# Altium schematic sheet SignalGen_SingleChannel.SchDoc
size A; SheetNumber: 2; SheetTotal: 2
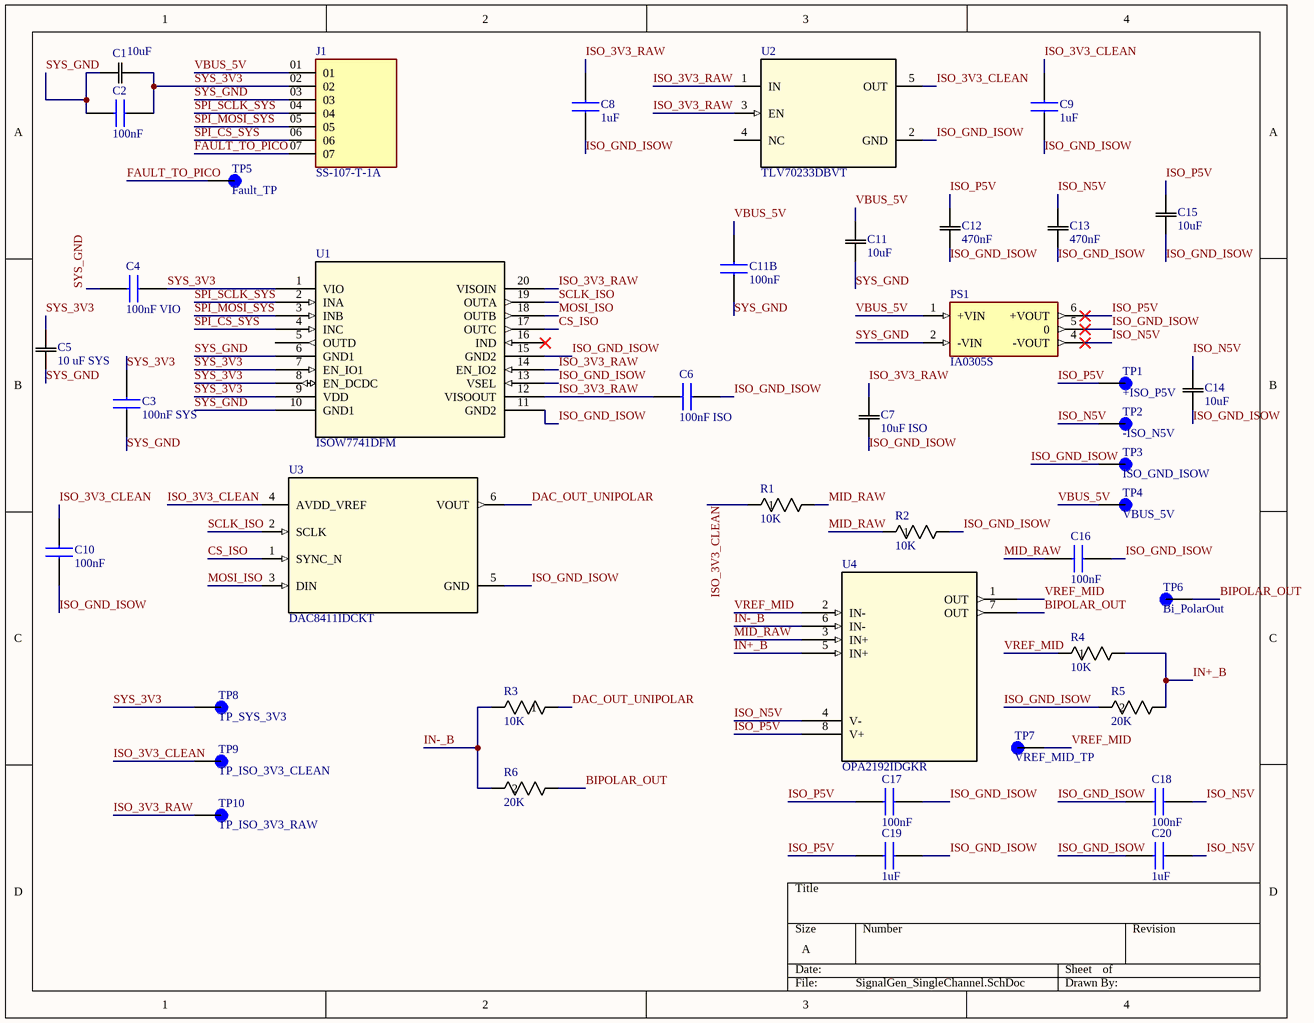
[diagram p0: SignalGen_SingleChannel.SchDoc]

## Parts
C1  10uF  [G-21_MUR]
C2  100nF  [CAPC1608X90N]
C3  100nF SYS  [CAPC1608X90N]
C4  100nF VIO  [CAPC1608X90N]
C5  10 uF SYS  [G-21_MUR]
C6  100nF ISO  [CAPC1608X90N]
C7  10uF ISO  [G-21_MUR]
C8  1uF  [INDC1608X90N]
C9  1uF  [INDC1608X90N]
C10  100nF  [CAPC1608X90N]
C11  10uF  [G-21_MUR]
C11B  100nF  [CAPC1608X90N]
C12  470nF  [CAP_1608_TDK]
C13  470nF  [CAP_1608_TDK]
C14  10uF  [G-21_MUR]
C15  10uF  [G-21_MUR]
C16  100nF  [CAPC1608X90N]
C17  100nF  [CAPC1608X90N]
C18  100nF  [CAPC1608X90N]
C19  1uF  [INDC1608X90N]
C20  1uF  [INDC1608X90N]
J1  SS-107-T-1A  [SAMTEC_SS-107-T-1A]
PS1  IA0305S  [XP_IA0305S]
R1  10K  [RC0603N_YAG]
R2  10K  [RC0603N_YAG]
R3  10K  [RC0603N_YAG]
R4  10K  [RC0603N_YAG]
R5  20K  [RC0603N_YAG]
R6  20K  [RC0603N_YAG]
TP1  +ISO_P5V  [KEYSTONE_5016]
TP2  -ISO_N5V  [KEYSTONE_5016]
TP3  ISO_GND_ISOW  [KEYSTONE_5016]
TP4  VBUS_5V  [KEYSTONE_5016]
TP5  Fault_TP  [KEYSTONE_5016]
TP6  Bi_PolarOut  [KEYSTONE_5016]
TP7  VREF_MID_TP  [KEYSTONE_5016]
TP8  TP_SYS_3V3  [KEYSTONE_5016]
TP9  TP_ISO_3V3_CLEAN  [KEYSTONE_5016]
TP10  TP_ISO_3V3_RAW  [KEYSTONE_5016]
U1  ISOW7741DFM  [SOIC20_DFM_TEX]
U2  TLV70233DBVT  [DBV0005A_N]
U3  DAC8411IDCKT  [DCK0006A_N]
U4  OPA2192IDGKR  [DGK0008A_N_TEX]

## Nets
BIPOLAR_OUT: R6.1 TP6.TP U4.7(OUT)
CS_ISO: U1.17(OUTC) U3.1(SYNC_N)
DAC_OUT_UNIPOLAR: R3.1 U3.6(VOUT)
FAULT_TO_PICO: J1.07 TP5.TP
IN+_B: R4.2 R5.1 U4.5(IN+)
IN-_B: R3.2 R6.2 U4.6(IN-)
ISO_3V3_CLEAN: C9.2 C10.2 R1.1 TP9.TP U2.5(OUT) U3.4(AVDD_VREF)
ISO_3V3_RAW: C6.2 C7.2 C8.2 TP10.TP U1.12(VISOOUT) U1.14(EN_IO2) U1.20(VISOIN) U2.1(IN) U2.3(EN)
ISO_GND_ISOW: C6.1 C7.1 C8.1 C9.1 C10.1 C12.1 C13.1 C14.1 C15.1 C16.2 C17.2 C18.1 C19.2 C20.1 PS1.5(0) R2.2 R5.2 TP3.TP U1.11(GND2) U1.13(VSEL) U1.15(GND2) U2.2(GND) U3.5(GND)
ISO_N5V: C13.2 C14.2 C18.2 C20.2 PS1.4(-VOUT) TP2.TP U4.4(V-)
ISO_P5V: C12.2 C15.2 C17.1 C19.1 PS1.6(+VOUT) TP1.TP U4.8(V+)
MID_RAW: C16.1 R1.2 R2.1 U4.3(IN+)
MOSI_ISO: U1.18(OUTB) U3.3(DIN)
SCLK_ISO: U1.19(OUTA) U3.2(SCLK)
SPI_CS_SYS: J1.06 U1.4(INC)
SPI_MOSI_SYS: J1.05 U1.3(INB)
SPI_SCLK_SYS: J1.04 U1.2(INA)
SYS_3V3: C1.1 C2.1 C3.2 C4.1 C5.2 J1.02 TP8.TP U1.1(VIO) U1.7(EN_IO1) U1.8(EN_DCDC) U1.9(VDD)
SYS_GND: C1.2 C2.2 C3.1 C4.2 C5.1 C11.1 C11B.1 J1.03 PS1.2(-VIN) U1.6(GND1) U1.10(GND1)
VBUS_5V: C11.2 C11B.2 J1.01 PS1.1(+VIN) TP4.TP
VREF_MID: R4.1 TP7.TP U4.1(OUT) U4.2(IN-)

Not connected (* = marked no-connect by the designer): U1 5(OUTD) 16(IND)*; U2 4(NC)

## Library data of the parts
C1 C5 C7 C11 C14 C15 = GRM21BR61E106KA73L: Description; Manufacturer_Name: Murata; Copyright: Copyright (C) 2025 Ultra Librarian. All rights reserved.; Manufacturer_Part_Number: GRM21BR61E106KA73L
C2-C4 C6 C10 C11B C16-C18 = CC0603KRX7R8BB104: Cap Ceramic 0.1uF 25V X7R 10% Pad SMD 0603 125C T/R; Manufacturer_Name: YAGEO; Geometry.Height: 0.9mm; Mouser Part Number: 603-CC603KRX7R8BB104; Mouser Price/Stock: https://www.mouser.co.uk/ProductDetail/YAGEO/CC0603KRX7R8BB104?qs=AgBp2OyFlx%252B4QOgEm%2Fb3YQ%3D%3D; Manufacturer_Part_Number: CC0603KRX7R8BB104; Datasheet Link: https://www.arrow.com/en/products/cc0603krx7r8bb104/yageo?region=nac
C8 C9 C19 C20 = MBASE168SB7105KTNA18: Taiyo Yuden CAP, MLCC, 0603, 16V, X7R, 1 uF 10 %, T&R; Geometry.Height: 0.9mm; Mouser Part Number: *; Mouser Price/Stock: *; Manufacturer_Name: TAIYO YUDEN; Manufacturer_Part_Number: MBASE168SB7105KTNA18; Datasheet Link: https://ds.yuden.co.jp/TYCOMPAS/ut/specSheet?pn=MBASE168SB7105KTNA18
C12 C13 = C1608X7R1H474K080AC: CAPACITOR; SMT (0603); CERAMIC CHIP; 0.47UF; 50V; TOL=10%; TG=-55 DEGC TO +125 DEGC; TC=X7R; AUTO; Manufacturer_Name: TDK; Copyright: Copyright (C) 2026 Ultra Librarian. All rights reserved.; Manufacturer_Part_Number: C1608X7R1H474K080AC
PS1 = IA0305S: DC DC CONVERTER +/-5V 1W; Package: None; Price: None; Value: *; MP: IA0305S; Availability: Unavailable
R1-R4 = RC0603FR-0710KL: RES SMD 10kO 1% 1/10W 0603; Manufacturer_Name: Yageo; Copyright: Copyright (C) 2025 Ultra Librarian. All rights reserved.; Manufacturer_Part_Number: RC0603FR-0710KL
R5 R6 = RC0603FR-0720KL: Description; Manufacturer_Name: Yageo; Copyright: Copyright (C) 2025 Ultra Librarian. All rights reserved.; Manufacturer_Part_Number: RC0603FR-0720KL
TP1-TP10 = 5016: Test Point Compact SMT Phos Bronze/Silver 1000pc Tape & Reel | Keystone Electronics 5016; SnapEDA_Link: https://www.snapeda.com/parts/5016/Keystone/view-part/?ref=snap; Package: NON STANDARD-1 Keystone; Value: *; MF: Keystone Electronics; MP: 5016; Check_prices: https://www.snapeda.com/parts/5016/Keystone/view-part/?ref=eda
U1 = ISOW7741DFM: Low-emissions, low-ripple, quad-channel, 3/1, reinforced digital isolator with integrated power 20-SOIC -40 to 125; Manufacturer_Name: Texas Instruments; Copyright: Copyright (C) 2026 Ultra Librarian. All rights reserved.; Manufacturer_Part_Number: ISOW7741DFM; RefDes: RefDes; Type: Type
U2 = TLV70233DBVT: 300-mA, high-PSRR, low-IQ, low-dropout voltage regulator with enable 5-SOT-23 -40 to 125; Manufacturer_Name: Texas Instruments; PartNumber: TLV70212DBVR; Alternate_PartNumber: TLV70212DBVT; CompType: IC; TYPE: TYPE; RefDes: RefDes; Copyright: Copyright (C) 2026 Ultra Librarian. All rights reserved.; Manufacturer_Part_Number: TLV70233DBVT; Application_BuildNumber: *; PackageReference: DBV0005A; MountType: SMT; RoHS: Y; Manufacturer: Texas Instruments
U3 = DAC8411IDCKT: 16bit, Single Channel, 80uA, 2.0V-5.5V DAC in SC70 Package 6-SC70 -40 to 125; Manufacturer_Name: Texas Instruments; PartNumber: DAC8411IDCKR; CompType: IC; TYPE: TYPE; RefDes: RefDes; Copyright: Copyright (C) 2025 Ultra Librarian. All rights reserved.; Manufacturer_Part_Number: DAC8411IDCKT; Application_BuildNumber: *; Alternate_PartNumber: DAC8411IDCKT; PackageReference: DCK0006A; MountType: SMT; RoHS: Y; Manufacturer: Texas Instruments
U4 = OPA2192IDGKR: 36-V, Precision, RRIO, Low Offset Voltage, Low Input Bias Current Op Amp With e-trim 8-VSSOP -40 to 125; Manufacturer_Name: Texas Instruments; Copyright: Copyright (C) 2025 Ultra Librarian. All rights reserved.; Manufacturer_Part_Number: OPA2192IDGKR; RefDes: RefDes; Type: Type
J1 = SS-107-T-1A: Package: None; Price: None; Value: *; MP: SS-107-T-1A; Availability: Unavailable